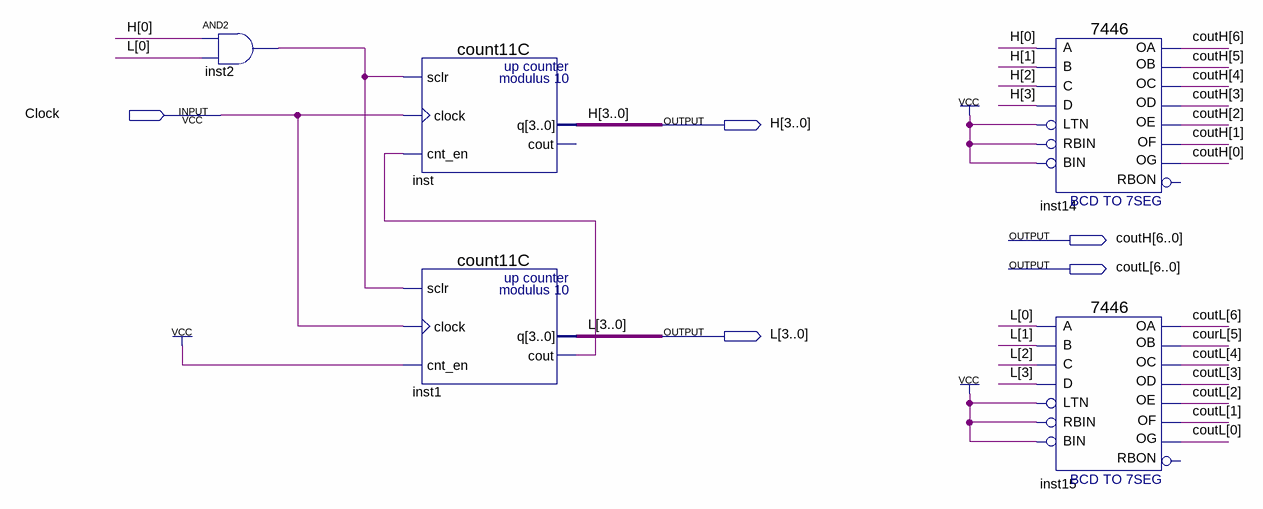
[diagram p0: schematic sheet]
// Quartus schematic cnt11C.bdf as structural Verilog: 5 symbols, 5 pins
module cnt11C (
  input  Clock,
  output [3:0] H,
  output [6:0] coutH,
  output [6:0] coutL,
  output [3:0] L
);

  wire inst1_cout, inst2_out;
  wire [5:5] courL;

  and inst2 (inst2_out, H[0], L[0]);
  count11C inst (.sclr(inst2_out), .clock(Clock), .cnt_en(inst1_cout), .q(H));  // open: cout
  count11C inst1 (.sclr(inst2_out), .clock(Clock), .cnt_en(1'b1), .q(L), .cout(inst1_cout));
  \7446  inst14 (
    .D(H[3]), .C(H[2]), .B(H[1]), .LTN(1'b1), .A(H[0]), .RBIN(1'b1), .BIN(1'b1), .OC(coutH[4]),
    .OD(coutH[3]), .OE(coutH[2]), .OA(coutH[6]), .OB(coutH[5]), .OF(coutH[1]), .OG(coutH[0]));  // open: RBON
  \7446  inst15 (
    .D(L[3]), .C(L[2]), .B(L[1]), .LTN(1'b1), .A(L[0]), .RBIN(1'b1), .BIN(1'b1), .OC(coutL[4]),
    .OD(coutL[3]), .OE(coutL[2]), .OA(coutL[6]), .OB(courL[5]), .OF(coutL[1]), .OG(coutL[0]));  // open: RBON
endmodule
